# Altium project analogtestboard3.PRJPCB
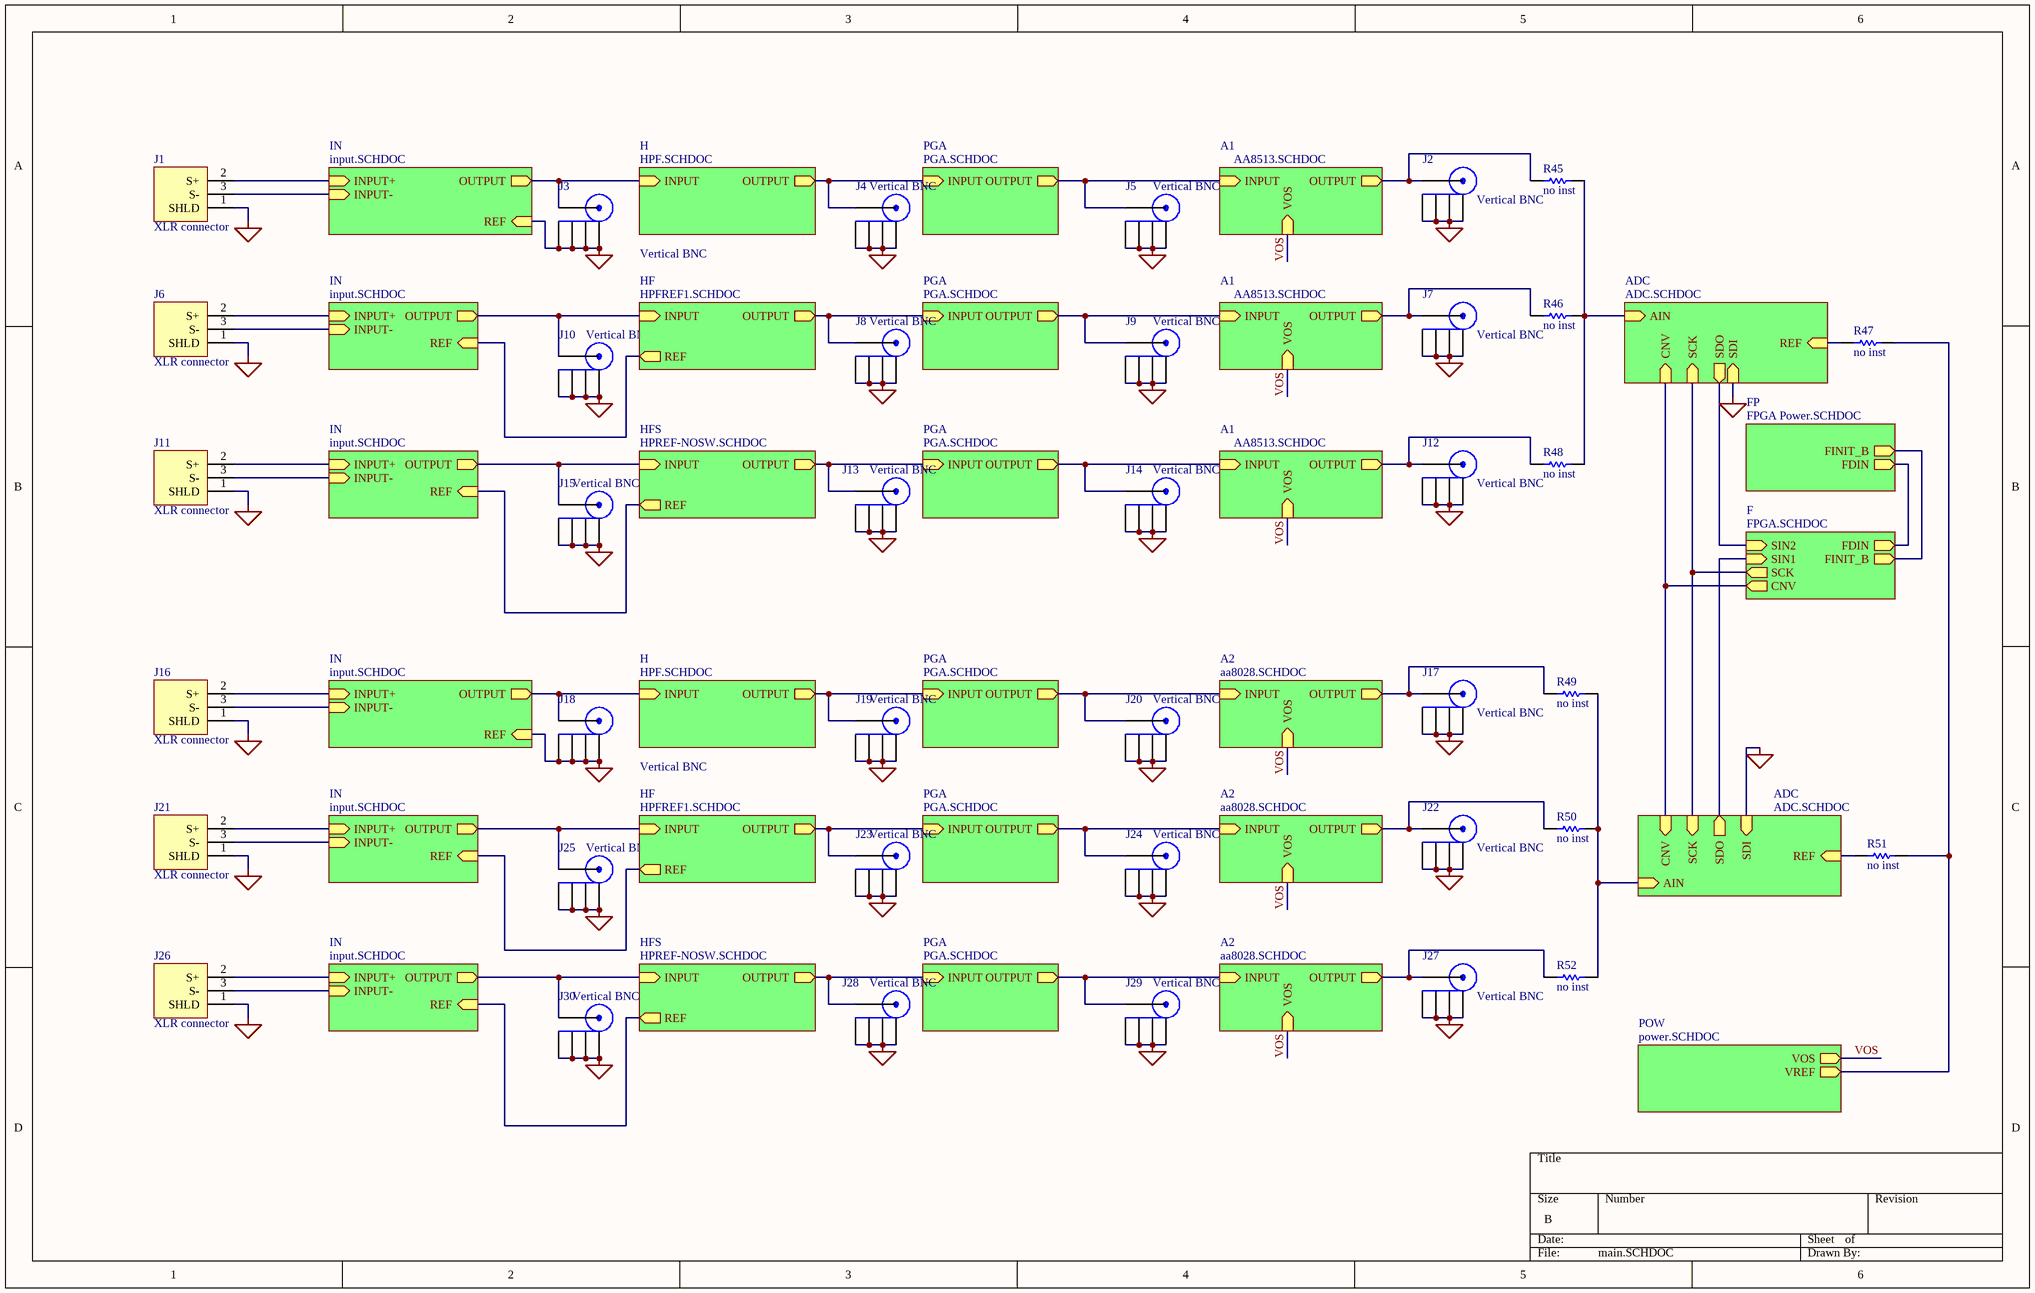
[diagram p0: main.SCHDOC]
12 sheets, 448 parts. Net scope: hierarchical (ports join the sheet entries above them; power ports are global).
Board file: analogtestboard3.PCBDOC
Sheets:
  main.SCHDOC
    IN = input.SCHDOC
    IN = input.SCHDOC
    A1 = AA8513.SCHDOC
    HF = HPFREF1.SCHDOC
    PGA = PGA.SCHDOC
    H = HPF.SCHDOC
    IN = input.SCHDOC
    PGA = PGA.SCHDOC
    PGA = PGA.SCHDOC
    A1 = AA8513.SCHDOC
    A1 = AA8513.SCHDOC
    HFS = HPREF-NOSW.SCHDOC
    IN = input.SCHDOC
    IN = input.SCHDOC
    HF = HPFREF1.SCHDOC
    PGA = PGA.SCHDOC
    H = HPF.SCHDOC
    IN = input.SCHDOC
    PGA = PGA.SCHDOC
    PGA = PGA.SCHDOC
    HFS = HPREF-NOSW.SCHDOC
    A2 = aa8028.SCHDOC
    A2 = aa8028.SCHDOC
    A2 = aa8028.SCHDOC
    ADC = ADC.SCHDOC
    ADC = ADC.SCHDOC
    F = FPGA.SCHDOC
    POW = power.SCHDOC
    FP = FPGA Power.SCHDOC

## Sheet main.SCHDOC
size B

### Parts
J1  XLR connector  [NC3FAH-0]
J2  Vertical BNC  [Vertical BNC 227699-1]
J3  Vertical BNC  [Vertical BNC 227699-1]
J4  Vertical BNC  [Vertical BNC 227699-1]
J5  Vertical BNC  [Vertical BNC 227699-1]
J6  XLR connector  [NC3FAH-0]
J7  Vertical BNC  [Vertical BNC 227699-1]
J8  Vertical BNC  [Vertical BNC 227699-1]
J9  Vertical BNC  [Vertical BNC 227699-1]
J10  Vertical BNC  [Vertical BNC 227699-1]
J11  XLR connector  [NC3FAH-0]
J12  Vertical BNC  [Vertical BNC 227699-1]
J13  Vertical BNC  [Vertical BNC 227699-1]
J14  Vertical BNC  [Vertical BNC 227699-1]
J15  Vertical BNC  [Vertical BNC 227699-1]
J16  XLR connector  [NC3FAH-0]
J17  Vertical BNC  [Vertical BNC 227699-1]
J18  Vertical BNC  [Vertical BNC 227699-1]
J19  Vertical BNC  [Vertical BNC 227699-1]
J20  Vertical BNC  [Vertical BNC 227699-1]
J21  XLR connector  [NC3FAH-0]
J22  Vertical BNC  [Vertical BNC 227699-1]
J23  Vertical BNC  [Vertical BNC 227699-1]
J24  Vertical BNC  [Vertical BNC 227699-1]
J25  Vertical BNC  [Vertical BNC 227699-1]
J26  XLR connector  [NC3FAH-0]
J27  Vertical BNC  [Vertical BNC 227699-1]
J28  Vertical BNC  [Vertical BNC 227699-1]
J29  Vertical BNC  [Vertical BNC 227699-1]
J30  Vertical BNC  [Vertical BNC 227699-1]
R45  no inst  [1206]
R46  no inst  [1206]
R47  no inst  [1206]
R48  no inst  [1206]
R49  no inst  [1206]
R50  no inst  [1206]
R51  no inst  [1206]
R52  no inst  [1206]

### Sub-sheets
A1 = AA8513.SCHDOC: OUTPUT (out), INPUT (in), VOS (in)
A1 = AA8513.SCHDOC: OUTPUT (out), INPUT (in), VOS (in)
A1 = AA8513.SCHDOC: OUTPUT (out), INPUT (in), VOS (in)
A2 = aa8028.SCHDOC: OUTPUT (out), INPUT (in), VOS (in)
A2 = aa8028.SCHDOC: OUTPUT (out), INPUT (in), VOS (in)
A2 = aa8028.SCHDOC: OUTPUT (out), INPUT (in), VOS (in)
ADC = ADC.SCHDOC: AIN (in), REF (in), SDI (in), SCK (in), SDO (out), CNV (in)
ADC = ADC.SCHDOC: AIN (in), REF (in), SDI (in), SCK (in), SDO (out), CNV (in)
F = FPGA.SCHDOC: FDIN (out), FINIT_B (out), SIN2 (in), SIN1 (in), SCK (out), CNV (out)
FP = FPGA Power.SCHDOC: FDIN (out), FINIT_B (out)
H = HPF.SCHDOC: INPUT (in), OUTPUT (out)
H = HPF.SCHDOC: INPUT (in), OUTPUT (out)
HF = HPFREF1.SCHDOC: INPUT (in), OUTPUT (out), REF (out)
HF = HPFREF1.SCHDOC: INPUT (in), OUTPUT (out), REF (out)
HFS = HPREF-NOSW.SCHDOC: INPUT (in), OUTPUT (out), REF (out)
HFS = HPREF-NOSW.SCHDOC: INPUT (in), OUTPUT (out), REF (out)
IN = input.SCHDOC: INPUT+ (in), INPUT- (in), OUTPUT (out), REF (in)
IN = input.SCHDOC: INPUT+ (in), INPUT- (in), OUTPUT (out), REF (in)
IN = input.SCHDOC: INPUT+ (in), INPUT- (in), OUTPUT (out), REF (in)
IN = input.SCHDOC: INPUT+ (in), INPUT- (in), OUTPUT (out), REF (in)
IN = input.SCHDOC: INPUT+ (in), INPUT- (in), OUTPUT (out), REF (in)
IN = input.SCHDOC: INPUT+ (in), INPUT- (in), OUTPUT (out), REF (in)
PGA = PGA.SCHDOC: OUTPUT (out), INPUT (in)
PGA = PGA.SCHDOC: OUTPUT (out), INPUT (in)
PGA = PGA.SCHDOC: OUTPUT (out), INPUT (in)
PGA = PGA.SCHDOC: OUTPUT (out), INPUT (in)
PGA = PGA.SCHDOC: OUTPUT (out), INPUT (in)
PGA = PGA.SCHDOC: OUTPUT (out), INPUT (in)
POW = power.SCHDOC: VOS (out), VREF (out)

### Nets
AGND: J1.1(SHLD) J2.2(SHLD) J2.3(SHLD) J2.4(SHLD) J2.5(SHLD) J3.2(SHLD) J3.3(SHLD) J3.4(SHLD) J3.5(SHLD) J4.2(SHLD) J4.3(SHLD) J4.4(SHLD) J4.5(SHLD) J5.2(SHLD) J5.3(SHLD) J5.4(SHLD) J5.5(SHLD) J6.1(SHLD) J7.2(SHLD) J7.3(SHLD) J7.4(SHLD) J7.5(SHLD) J8.2(SHLD) J8.3(SHLD) J8.4(SHLD) J8.5(SHLD) J9.2(SHLD) J9.3(SHLD) J9.4(SHLD) J9.5(SHLD) J10.2(SHLD) J10.3(SHLD) J10.4(SHLD) J10.5(SHLD) J11.1(SHLD) J12.2(SHLD) J12.3(SHLD) J12.4(SHLD) J12.5(SHLD) J13.2(SHLD) J13.3(SHLD) J13.4(SHLD) J13.5(SHLD) J14.2(SHLD) J14.3(SHLD) J14.4(SHLD) J14.5(SHLD) J15.2(SHLD) J15.3(SHLD) J15.4(SHLD) J15.5(SHLD) J16.1(SHLD) J17.2(SHLD) J17.3(SHLD) J17.4(SHLD) J17.5(SHLD) J18.2(SHLD) J18.3(SHLD) J18.4(SHLD) J18.5(SHLD) J19.2(SHLD) J19.3(SHLD) J19.4(SHLD) J19.5(SHLD) J20.2(SHLD) J20.3(SHLD) J20.4(SHLD) J20.5(SHLD) J21.1(SHLD) J22.2(SHLD) J22.3(SHLD) J22.4(SHLD) J22.5(SHLD) J23.2(SHLD) J23.3(SHLD) J23.4(SHLD) J23.5(SHLD) J24.2(SHLD) J24.3(SHLD) J24.4(SHLD) J24.5(SHLD) J25.2(SHLD) J25.3(SHLD) J25.4(SHLD) J25.5(SHLD) J26.1(SHLD) J27.2(SHLD) J27.3(SHLD) J27.4(SHLD) J27.5(SHLD) J28.2(SHLD) J28.3(SHLD) J28.4(SHLD) J28.5(SHLD) J29.2(SHLD) J29.3(SHLD) J29.4(SHLD) J29.5(SHLD) J30.2(SHLD) J30.3(SHLD) J30.4(SHLD) J30.5(SHLD) ; sheet IN/REF, sheet IN/REF, sheet ADC/SDI, sheet ADC/SDI
FDIN: sheet F/FDIN, sheet FP/FDIN
FINIT_B: sheet F/FINIT_B, sheet FP/FINIT_B
VOS: sheet A1/VOS, sheet A1/VOS, sheet A1/VOS, sheet A2/VOS, sheet A2/VOS, sheet A2/VOS, sheet POW/VOS
VREF: R47.2 R51.2 ; sheet POW/VREF
NetC4:A21_1: J17.1(PIN) R49.1 ; sheet A2/OUTPUT
NetC4:A22_1: J22.1(PIN) R50.1 ; sheet A2/OUTPUT
NetC4:A23_1: J27.1(PIN) R52.1 ; sheet A2/OUTPUT
NetC20:A11_1: J7.1(PIN) R46.1 ; sheet A1/OUTPUT
NetC20:A12_1: J12.1(PIN) R48.1 ; sheet A1/OUTPUT
NetC20:A13_1: J2.1(PIN) R45.1 ; sheet A1/OUTPUT
NetC33:ADC1_2: R47.1 ; sheet ADC/REF
NetC33:ADC2_2: R51.1 ; sheet ADC/REF
NetC57:H1_2: J3.1(PIN) ; sheet IN/OUTPUT, sheet H/INPUT
NetC57:H2_2: J18.1(PIN) ; sheet IN/OUTPUT, sheet H/INPUT
NetC63:HFS1_2: sheet IN/REF, sheet HFS/REF
NetC63:HFS2_2: sheet IN/REF, sheet HFS/REF
NetJ1_2: J1.2(S+) ; sheet IN/INPUT+
NetJ1_3: J1.3(S-) ; sheet IN/INPUT-
NetJ4_1: J4.1(PIN) ; sheet H/OUTPUT, sheet PGA/INPUT
NetJ5_1: J5.1(PIN) ; sheet PGA/OUTPUT, sheet A1/INPUT
NetJ6_2: J6.2(S+) ; sheet IN/INPUT+
NetJ6_3: J6.3(S-) ; sheet IN/INPUT-
NetJ8_1: J8.1(PIN) J10.1(PIN) ; sheet IN/OUTPUT, sheet HF/INPUT, sheet HF/OUTPUT, sheet PGA/INPUT
NetJ9_1: J9.1(PIN) ; sheet A1/INPUT, sheet PGA/OUTPUT
NetJ11_2: J11.2(S+) ; sheet IN/INPUT+
NetJ11_3: J11.3(S-) ; sheet IN/INPUT-
NetJ13_1: J13.1(PIN) J15.1(PIN) ; sheet IN/OUTPUT, sheet PGA/INPUT, sheet HFS/INPUT, sheet HFS/OUTPUT
NetJ14_1: J14.1(PIN) ; sheet PGA/OUTPUT, sheet A1/INPUT
NetJ16_2: J16.2(S+) ; sheet IN/INPUT+
NetJ16_3: J16.3(S-) ; sheet IN/INPUT-
NetJ19_1: J19.1(PIN) ; sheet H/OUTPUT, sheet PGA/INPUT
NetJ20_1: J20.1(PIN) ; sheet PGA/OUTPUT, sheet A2/INPUT
NetJ21_2: J21.2(S+) ; sheet IN/INPUT+
NetJ21_3: J21.3(S-) ; sheet IN/INPUT-
NetJ23_1: J23.1(PIN) J25.1(PIN) ; sheet IN/OUTPUT, sheet HF/INPUT, sheet HF/OUTPUT, sheet PGA/INPUT
NetJ24_1: J24.1(PIN) ; sheet PGA/OUTPUT, sheet A2/INPUT
NetJ26_2: J26.2(S+) ; sheet IN/INPUT+
NetJ26_3: J26.3(S-) ; sheet IN/INPUT-
NetJ28_1: J28.1(PIN) J30.1(PIN) ; sheet IN/OUTPUT, sheet PGA/INPUT, sheet HFS/INPUT, sheet HFS/OUTPUT
NetJ29_1: J29.1(PIN) ; sheet PGA/OUTPUT, sheet A2/INPUT
NetR25:ADC1_1: R45.2 R46.2 R48.2 ; sheet ADC/AIN
NetR25:ADC2_1: R49.2 R50.2 R52.2 ; sheet ADC/AIN
NetR27_2: sheet ADC/SDO, sheet F/SIN2
NetR28_1: sheet ADC/SCK, sheet ADC/SCK, sheet F/SCK
NetR29_1: sheet ADC/CNV, sheet ADC/CNV, sheet F/CNV
NetU5:ADC2_7: sheet ADC/SDO, sheet F/SIN1
NetU11:HF1_1: sheet IN/REF, sheet HF/REF
NetU11:HF2_1: sheet IN/REF, sheet HF/REF

### Library data of the parts
J1 J6 J11 J16 J21 J26 = XLR: XLR balanced connector, standard
J2-J5 J7-J10 J12-J15 J17-J20 J22-J25 J27-J30 = VERTBNC: Vertical BNC with correct grounding pin behavior
R45-R52 = Res1: Resistor; Value: 0; Published: 8-Jun-2000; LatestRevisionDate: 17-Jul-2002; LatestRevisionNote: Re-released for DXP Platform.; Publisher: Altium Limited

## Sheet input.SCHDOC
size B
Used 6 times, as channels IN, IN, IN, IN, IN, IN. Parts and nets are listed once, with the designators drawn on the sheet.
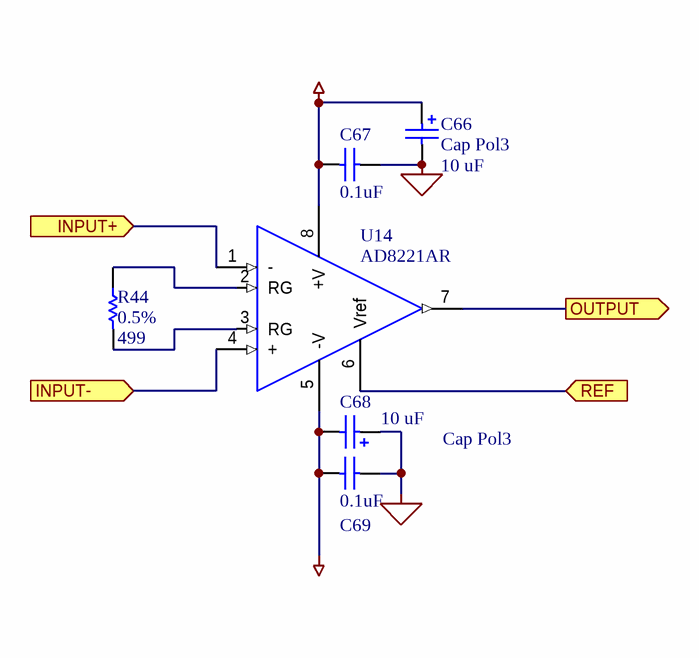
[diagram p1: input.SCHDOC]

### Parts
C66  Cap Pol3  value 10 uF  [TC3216-1206]
C67  value 0.1uF  [CC1608-0603]  (hidden comment: Cap)
C68  Cap Pol3  value 10 uF  [TC3216-1206]
C69  value 0.1uF  [CC1608-0603]  (hidden comment: Cap)
R44  0.5%  value 499  [R2012-0805]
U14  AD8221AR  [SO-G8]

### Ports
INPUT+ (in), INPUT- (in), OUTPUT (out), REF (in)

### Nets
AGND: C66.2 C67.2 C68.1 C69.2
AVDD: C66.1 C67.1 U14.8(+V)
AVSS: C68.2 C69.1 U14.5(-V)
INPUT+: U14.1(-) ; port INPUT+
INPUT-: U14.4(+) ; port INPUT-
OUTPUT: U14.7(Vout) ; port OUTPUT
REF: U14.6(Vref) ; port REF
NetR44_1: R44.1 U14.2(RG)
NetR44_2: R44.2 U14.3(RG)

### Channels
IN: designators end in :IN1; ports INPUT+=NetJ6_2 INPUT-=NetJ6_3 OUTPUT=NetJ8_1 REF=NetU11:HF1_1
IN: designators end in :IN2; ports INPUT+=NetJ1_2 INPUT-=NetJ1_3 OUTPUT=NetC57:H1_2 REF=AGND
IN: designators end in :IN3; ports INPUT+=NetJ11_2 INPUT-=NetJ11_3 OUTPUT=NetJ13_1 REF=NetC63:HFS1_2
IN: designators end in :IN4; ports INPUT+=NetJ21_2 INPUT-=NetJ21_3 OUTPUT=NetJ23_1 REF=NetU11:HF2_1
IN: designators end in :IN5; ports INPUT+=NetJ16_2 INPUT-=NetJ16_3 OUTPUT=NetC57:H2_2 REF=AGND
IN: designators end in :IN6; ports INPUT+=NetJ26_2 INPUT-=NetJ26_3 OUTPUT=NetJ28_1 REF=NetC63:HFS2_2

### Library data of the parts
C66 C68 = Cap Pol3: Polarized Capacitor (Surface Mount); Manufacturer: Generic Components; Class I: Passive; Published: 8-Jun-2000; Revision: July-2002: Re-released for DXP Platform.; Publisher: Altium Limited; Class II: Capacitor
C67 C69 = Cap: Capacitor; Manufacturer: Generic Components; Class I: Passive; Published: 8-Jun-2000; Revision: July-2002: Re-released for DXP Platform.; Publisher: Altium Limited; Class II: Capacitor
R44 = Res1: RR1220P-4990-D-M; Manufacturer: Generic Components; Class I: Passive; Class II: Resistor; Published: 8-Jun-2000; Revision: July-2002: Re-released for DXP Platform.; Publisher: Altium Limited
U14 = AD8221: AD8221 Precision Instrumentation Amplifier

## Sheet AA8513.SCHDOC
size B
Used 3 times, as channels A1, A1, A1. Parts and nets are listed once, with the designators drawn on the sheet.
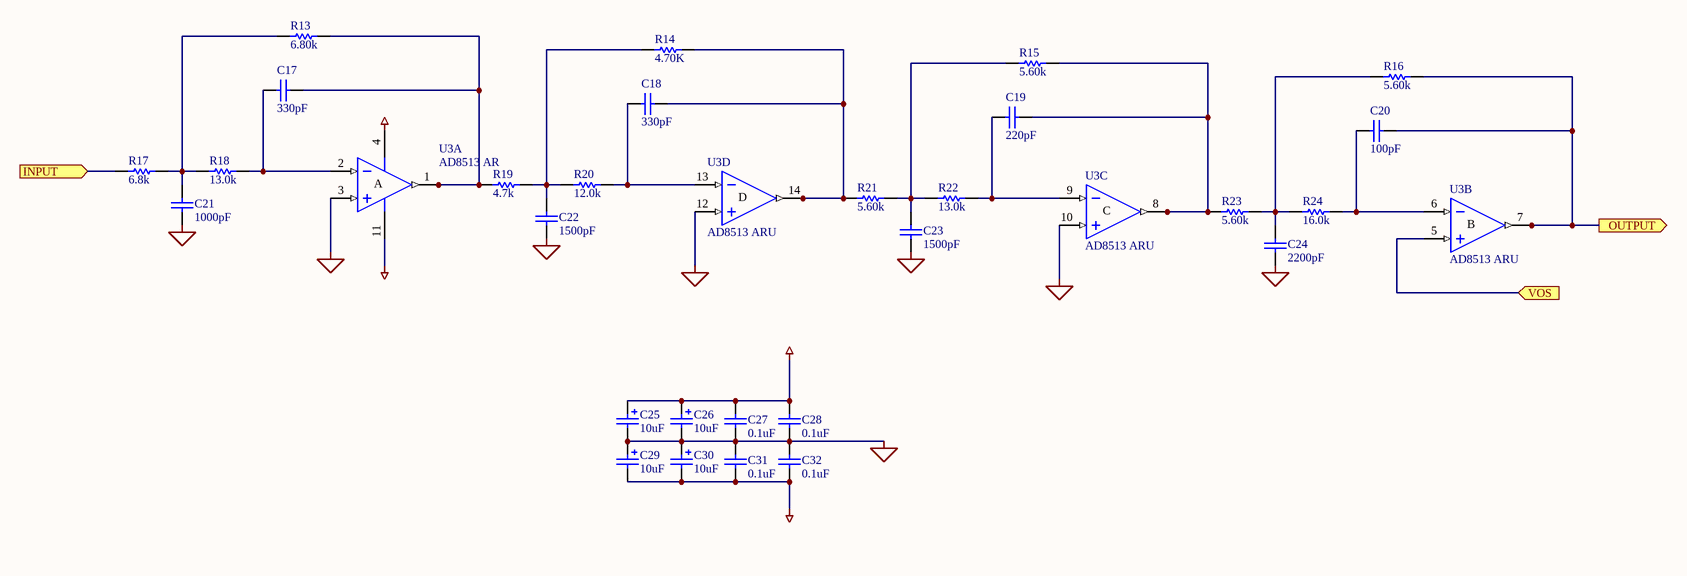
[diagram p2: AA8513.SCHDOC]

### Parts
C17  value 330pF  [CC1608-0603]  (hidden comment: Cap)
C18  value 330pF  [CC1608-0603]  (hidden comment: Cap)
C19  value 220pF  [CC1608-0603]  (hidden comment: Cap)
C20  value 100pF  [CC1608-0603]  (hidden comment: Cap)
C21  value 1000pF  [CC1608-0603]  (hidden comment: Cap)
C22  value 1500pF  [CC1608-0603]  (hidden comment: Cap)
C23  value 1500pF  [CC1608-0603]  (hidden comment: Cap)
C24  value 2200pF  [CC1608-0603]  (hidden comment: Cap)
C25  value 10uF  [TC3528-1411]  (hidden comment: Cap Pol1)
C26  value 10uF  [TC3528-1411]  (hidden comment: Cap Pol1)
C27  value 0.1uF  [CC1608-0603]  (hidden comment: Cap)
C28  value 0.1uF  [CC1608-0603]  (hidden comment: Cap)
C29  value 10uF  [TC3528-1411]  (hidden comment: Cap Pol1)
C30  value 10uF  [TC3528-1411]  (hidden comment: Cap Pol1)
C31  value 0.1uF  [CC1608-0603]  (hidden comment: Cap)
C32  value 0.1uF  [CC1608-0603]  (hidden comment: Cap)
R13  value 6.80k  [CC1608-0603]  (hidden comment: Res1)
R14  value 4.70K  [CC1608-0603]  (hidden comment: Res1)
R15  value 5.60k  [CC1608-0603]  (hidden comment: Res1)
R16  value 5.60k  [CC1608-0603]  (hidden comment: Res1)
R17  value 6.8k  [CC1608-0603]  (hidden comment: Res1)
R18  value 13.0k  [CC1608-0603]  (hidden comment: Res1)
R19  value 4.7k  [CC1608-0603]  (hidden comment: Res1)
R20  value 12.0k  [CC1608-0603]  (hidden comment: Res1)
R21  value 5.60k  [CC1608-0603]  (hidden comment: Res1)
R22  value 13.0k  [CC1608-0603]  (hidden comment: Res1)
R23  value 5.60k  [CC1608-0603]  (hidden comment: Res1)
R24  value 16.0k  [CC1608-0603]  (hidden comment: Res1)
U3  AD8513 AR  [SO-G14]  (parts A,B,C,D of 4)

### Ports
INPUT (in), OUTPUT (out), VOS (in)

### Nets
AGND: C21.1 C22.1 C23.1 C24.1 C25.2 C26.2 C27.1 C28.1 C29.1 C30.1 C31.2 C32.2 U3.3(IN+A) U3.10(IN+C) U3.12(IN+D)
AVDD: C25.1 C26.1 C27.2 C28.2 U3.4(V+)
AVSS: C29.2 C30.2 C31.1 C32.1 U3.11(V-)
INPUT: R17.1 ; port INPUT
OUTPUT: C20.1 R16.1 U3.7(OUTB) ; port OUTPUT
VOS: U3.5(IN+B) ; port VOS
NetC17_1: C17.1 R13.1 R19.1 U3.1(OUTA)
NetC17_2: C17.2 R18.2 U3.2(IN-A)
NetC18_1: C18.1 R14.1 R21.1 U3.14(OUTD)
NetC18_2: C18.2 R20.2 U3.13(IN-D)
NetC19_1: C19.1 R15.1 R23.1 U3.8(OUTC)
NetC19_2: C19.2 R22.2 U3.9(IN-C)
NetC20_2: C20.2 R24.2 U3.6(IN-B)
NetC21_2: C21.2 R13.2 R17.2 R18.1
NetC22_2: C22.2 R14.2 R19.2 R20.1
NetC23_2: C23.2 R15.2 R21.2 R22.1
NetC24_2: C24.2 R16.2 R23.2 R24.1

### Channels
A1: designators end in :A11; ports INPUT=NetJ9_1 OUTPUT=NetC20:A11_1 VOS=VOS
A1: designators end in :A12; ports INPUT=NetJ14_1 OUTPUT=NetC20:A12_1 VOS=VOS
A1: designators end in :A13; ports INPUT=NetJ5_1 OUTPUT=NetC20:A13_1 VOS=VOS

### Notes on the sheet
- (in symbol AD8513ARU, part A) A
- (in symbol AD8513ARU, part B) B
- (in symbol AD8513ARU, part C) C
- (in symbol AD8513ARU, part D) D

### Library data of the parts
C17-C24 C27 C28 C31 C32 = Cap: as C67 on sheet input; Published: 8-Jun-2000; Revision: July-2002: Re-released for DXP Platform.; Publisher: Altium Limited; Class II: Capacitor
C25 C26 C29 C30 = Cap Pol1: Polarized Capacitor (Radial); Manufacturer: Generic Components; Class I: Passive; Published: 8-Jun-2000; Revision: July-2002: Re-released for DXP Platform.; Publisher: Altium Limited; Class II: Capacitor
R13-R24 = Res1: Resistor; Manufacturer: Generic Components; Class I: Passive; Published: 8-Jun-2000; Revision: July-2002: Re-released for DXP Platform.; Publisher: Altium Limited; Class II: Resistor
U3 = AD8513ARU: low-noise JFET quad OA

## Sheet HPFREF1.SCHDOC
size B
Used 2 times, as channels HF, HF. Parts and nets are listed once, with the designators drawn on the sheet.
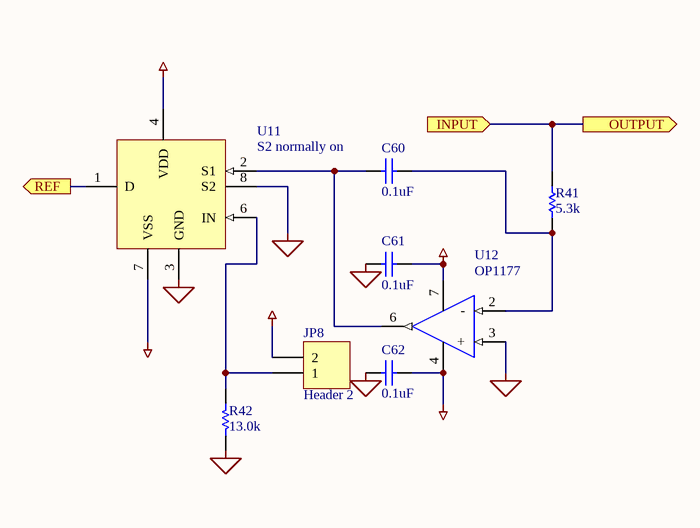
[diagram p3: HPFREF1.SCHDOC]

### Parts
C60  value 0.1uF  [CC3216-1206]  (hidden comment: Cap)
C61  value 0.1uF  [CC1608-0603]  (hidden comment: Cap)
C62  value 0.1uF  [CC1608-0603]  (hidden comment: Cap)
JP8  Header 2  [HDR1X2]
R41  value 5.3k  [CC2012-0805]  (hidden comment: Res1)
R42  value 13.0k  [CC2012-0805]  (hidden comment: Res1)
U11  S2 normally on  [MSOP8]
U12  OP1177  [SO-G8/X.6]

### Ports
INPUT (in), OUTPUT (out), REF (out)

### Nets
AGND: C61.1 C62.1 R42.1 U11.3(GND) U11.8(S2) U12.3(+)
AVDD: C61.2 JP8.2 U11.4(VDD) U12.7(+Vs)
AVSS: C62.2 U11.7(VSS) U12.4(-Vs)
INPUT: R41.1 ; port INPUT, port OUTPUT
REF: U11.1(D) ; port REF
NetC60_1: C60.1 R41.2 U12.2(-)
NetC60_2: C60.2 U11.2(S1) U12.6(Out)
NetJP8_1: JP8.1 R42.2 U11.6(IN)

### Channels
HF: designators end in :HF1; ports INPUT=NetJ8_1 OUTPUT=NetJ8_1 REF=NetU11:HF1_1
HF: designators end in :HF2; ports INPUT=NetJ23_1 OUTPUT=NetJ23_1 REF=NetU11:HF2_1

### Library data of the parts
C60-C62 = Cap: as C67 on sheet input; Published: 8-Jun-2000; Revision: July-2002: Re-released for DXP Platform.; Publisher: Altium Limited; Class II: Capacitor
JP8 = Header 2: Header, 2-Pin; Manufacturer: Generic Components; Class I: Connector; Revision: July-2002: Re-released for DXP Platform.; Publisher: Altium Limited
R41 R42 = Res1: as R13 on sheet AA8513; Published: 8-Jun-2000; Revision: July-2002: Re-released for DXP Platform.; Publisher: Altium Limited; Class II: Resistor
U11 = ADG619: Low RON SPDT Switch
U12 = OP1177: AD Precision Low Noise, Low Input Bias Current Operational Amplifier

## Sheet PGA.SCHDOC
size B
Used 6 times, as channels PGA, PGA, PGA, PGA, PGA, PGA. Parts and nets are listed once, with the designators drawn on the sheet.
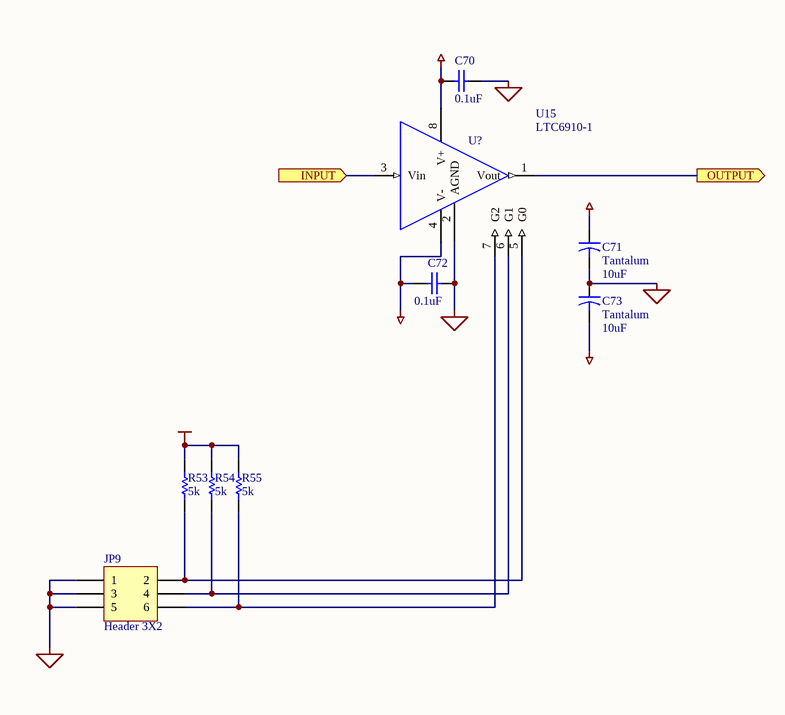
[diagram p4: PGA.SCHDOC]

### Parts
C70  value 0.1uF  [CC1608-0603]  (hidden comment: Cap)
C71  Tantalum  value 10uF  [TC3216-1206]
C72  value 0.1uF  [CC1608-0603]  (hidden comment: Cap)
C73  Tantalum  value 10uF  [TC3216-1206]
JP9  Header 3X2  [HDR2X3]
R53  value 5k  [CC2012-0805]  (hidden comment: Res1)
R54  value 5k  [CC2012-0805]  (hidden comment: Res1)
R55  value 5k  [CC2012-0805]  (hidden comment: Res1)
U15  LTC6910-1  [TSOT-23-8]

### Ports
INPUT (in), OUTPUT (out)

### Nets
AGND: C70.2 C71.2 C72.1 C73.1 JP9.1 JP9.3 JP9.5 U15.2(AGND)
AVDD: C70.1 C71.1 R53.2 R54.2 R55.2 U15.8(V+)
AVSS: C72.2 C73.2 U15.4(V-)
INPUT: U15.3(Vin) ; port INPUT
OUTPUT: U15.1(Vout) ; port OUTPUT
NetJP9_2: JP9.2 R53.1 U15.5(G0)
NetJP9_4: JP9.4 R54.1 U15.6(G1)
NetJP9_6: JP9.6 R55.1 U15.7(G2)

### Channels
PGA: designators end in :PGA1; ports INPUT=NetJ8_1 OUTPUT=NetJ9_1
PGA: designators end in :PGA2; ports INPUT=NetJ13_1 OUTPUT=NetJ14_1
PGA: designators end in :PGA3; ports INPUT=NetJ4_1 OUTPUT=NetJ5_1
PGA: designators end in :PGA4; ports INPUT=NetJ23_1 OUTPUT=NetJ24_1
PGA: designators end in :PGA5; ports INPUT=NetJ28_1 OUTPUT=NetJ29_1
PGA: designators end in :PGA6; ports INPUT=NetJ19_1 OUTPUT=NetJ20_1

### Notes on the sheet
- (in symbol LTC6910-2) U?

### Library data of the parts
C70 C72 = Cap: as C67 on sheet input; Published: 8-Jun-2000; Revision: July-2002: Re-released for DXP Platform.; Publisher: Altium Limited; Class II: Capacitor
C71 C73 = Cap2: Capacitor; Manufacturer: Generic Components; Class I: Passive; Published: 23-Sep-2002; Publisher: Altium Limited; Class II: Capacitor
JP9 = Header 3X2: Header, 3-Pin, Dual row; Manufacturer: Generic Components; Class I: Connector; Revision: July-2002: Re-released for DXP Platform.; Publisher: Altium Limited
R53-R55 = Res1: as R13 on sheet AA8513; Published: 8-Jun-2000; Revision: July-2002: Re-released for DXP Platform.; Publisher: Altium Limited; Class II: Resistor
U15 = LTC6910-2: LTI Digitally Controlled Programmabe Gain Amp

## Sheet HPF.SCHDOC
size B
Used 2 times, as channels H, H. Parts and nets are listed once, with the designators drawn on the sheet.
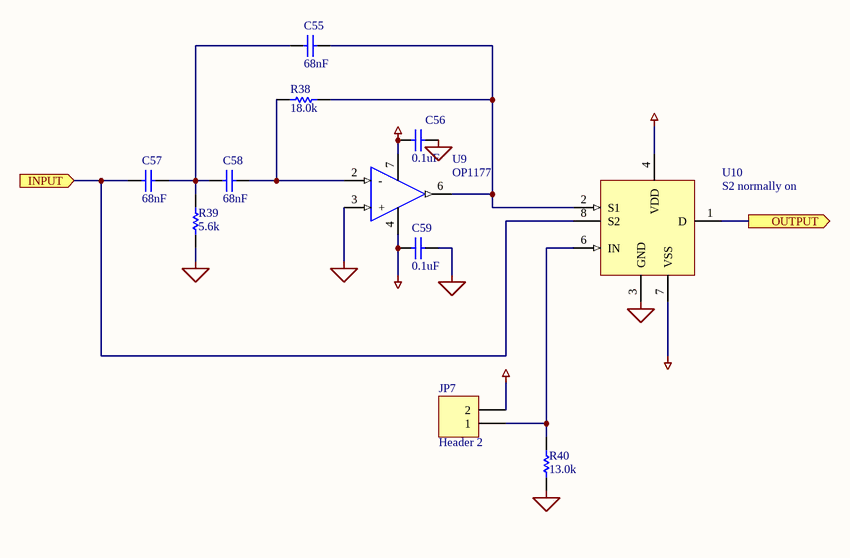
[diagram p5: HPF.SCHDOC]

### Parts
C55  value 68nF  [CC3216-1206]  (hidden comment: Cap)
C56  value 0.1uF  [CC1608-0603]  (hidden comment: Cap)
C57  value 68nF  [CC3216-1206]  (hidden comment: Cap)
C58  value 68nF  [CC3216-1206]  (hidden comment: Cap)
C59  value 0.1uF  [CC1608-0603]  (hidden comment: Cap)
JP7  Header 2  [HDR1X2]
R38  value 18.0k  [CC2012-0805]  (hidden comment: Res1)
R39  value 5.6k  [CC2012-0805]  (hidden comment: Res1)
R40  value 13.0k  [CC2012-0805]  (hidden comment: Res1)
U9  OP1177  [SO-G8/X.6]
U10  S2 normally on  [MSOP8]

### Ports
INPUT (in), OUTPUT (out)

### Nets
AGND: C56.2 C59.2 R39.1 R40.1 U9.3(+) U10.3(GND)
AVDD: C56.1 JP7.2 U9.7(+Vs) U10.4(VDD)
AVSS: C59.1 U9.4(-Vs) U10.7(VSS)
INPUT: C57.2 U10.8(S2) ; port INPUT
OUTPUT: U10.1(D) ; port OUTPUT
NetC55_1: C55.1 R38.1 U9.6(Out) U10.2(S1)
NetC55_2: C55.2 C57.1 C58.2 R39.2
NetC58_1: C58.1 R38.2 U9.2(-)
NetJP7_1: JP7.1 R40.2 U10.6(IN)

### Channels
H: designators end in :H1; ports INPUT=NetC57:H1_2 OUTPUT=NetJ4_1
H: designators end in :H2; ports INPUT=NetC57:H2_2 OUTPUT=NetJ19_1

### Library data of the parts
C55-C59 = Cap: as C67 on sheet input; Published: 8-Jun-2000; Revision: July-2002: Re-released for DXP Platform.; Publisher: Altium Limited; Class II: Capacitor
JP7 = Header 2: as JP8 on sheet HPFREF1; Revision: July-2002: Re-released for DXP Platform.; Publisher: Altium Limited
R38-R40 = Res1: as R13 on sheet AA8513; Published: 8-Jun-2000; Revision: July-2002: Re-released for DXP Platform.; Publisher: Altium Limited; Class II: Resistor
U9 = OP1177: as U12 on sheet HPFREF1
U10 = ADG619: Low RON SPDT Switch

## Sheet HPREF-NOSW.SCHDOC
size B
Used 2 times, as channels HFS, HFS. Parts and nets are listed once, with the designators drawn on the sheet.
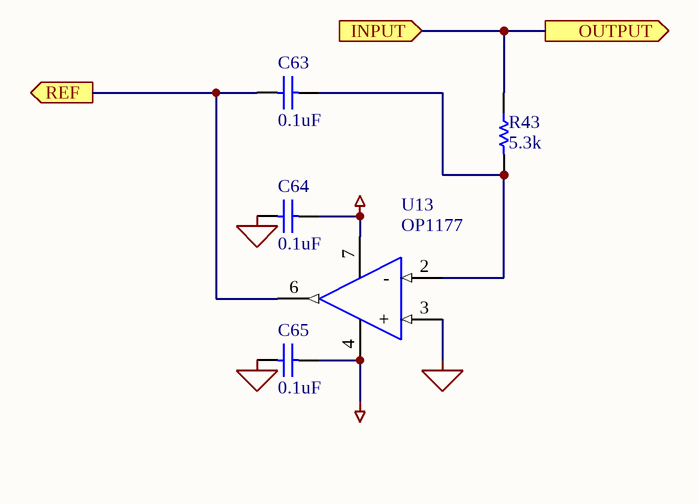
[diagram p6: HPREF-NOSW.SCHDOC]

### Parts
C63  value 0.1uF  [CC3216-1206]  (hidden comment: Cap)
C64  value 0.1uF  [CC1608-0603]  (hidden comment: Cap)
C65  value 0.1uF  [CC1608-0603]  (hidden comment: Cap)
R43  value 5.3k  [CC2012-0805]  (hidden comment: Res1)
U13  OP1177  [SO-G8/X.6]

### Ports
INPUT (in), OUTPUT (out), REF (out)

### Nets
AGND: C64.1 C65.1 U13.3(+)
AVDD: C64.2 U13.7(+Vs)
AVSS: C65.2 U13.4(-Vs)
INPUT: R43.1 ; port INPUT, port OUTPUT
REF: C63.2 U13.6(Out) ; port REF
NetC63_1: C63.1 R43.2 U13.2(-)

### Channels
HFS: designators end in :HFS1; ports INPUT=NetJ13_1 OUTPUT=NetJ13_1 REF=NetC63:HFS1_2
HFS: designators end in :HFS2; ports INPUT=NetJ28_1 OUTPUT=NetJ28_1 REF=NetC63:HFS2_2

### Library data of the parts
C63-C65 = Cap: as C67 on sheet input; Published: 8-Jun-2000; Revision: July-2002: Re-released for DXP Platform.; Publisher: Altium Limited; Class II: Capacitor
R43 = Res1: as R13 on sheet AA8513; Published: 8-Jun-2000; Revision: July-2002: Re-released for DXP Platform.; Publisher: Altium Limited; Class II: Resistor
U13 = OP1177: as U12 on sheet HPFREF1

## Sheet aa8028.SCHDOC
size B
Used 3 times, as channels A2, A2, A2. Parts and nets are listed once, with the designators drawn on the sheet.
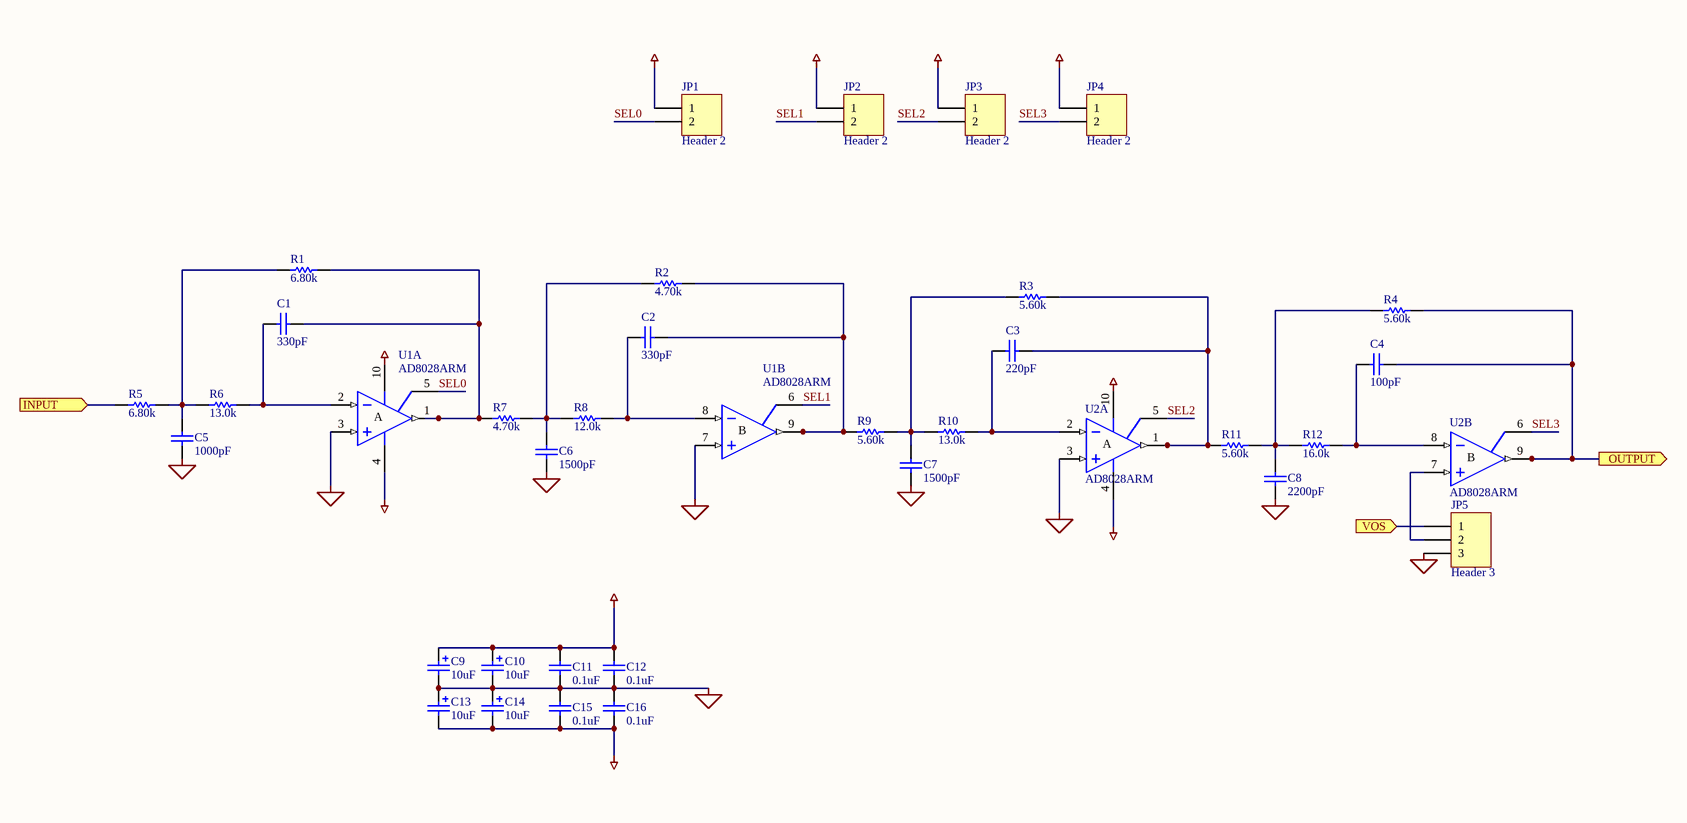
[diagram p7: aa8028.SCHDOC]

### Parts
C1  value 330pF  [0603]  (hidden comment: Cap)
C2  value 330pF  [0603]  (hidden comment: Cap)
C3  value 220pF  [0603]  (hidden comment: Cap)
C4  value 100pF  [0603]  (hidden comment: Cap)
C5  value 1000pF  [0603]  (hidden comment: Cap)
C6  value 1500pF  [0603]  (hidden comment: Cap)
C7  value 1500pF  [0603]  (hidden comment: Cap)
C8  value 2200pF  [0603]  (hidden comment: Cap)
C9  value 10uF  [TC3528-1411]  (hidden comment: Cap Pol1)
C10  value 10uF  [TC3528-1411]  (hidden comment: Cap Pol1)
C11  value 0.1uF  [CC1608-0603]  (hidden comment: Cap)
C12  value 0.1uF  [CC1608-0603]  (hidden comment: Cap)
C13  value 10uF  [TC3528-1411]  (hidden comment: Cap Pol1)
C14  value 10uF  [TC3528-1411]  (hidden comment: Cap Pol1)
C15  value 0.1uF  [CC1608-0603]  (hidden comment: Cap)
C16  value 0.1uF  [CC1608-0603]  (hidden comment: Cap)
JP1  Header 2  [HDR1X2]
JP2  Header 2  [HDR1X2]
JP3  Header 2  [HDR1X2]
JP4  Header 2  [HDR1X2]
JP5  Header 3  [HDR1X3]
R1  value 6.80k  [0603]  (hidden comment: Res1)
R2  value 4.70k  [0603]  (hidden comment: Res1)
R3  value 5.60k  [0603]  (hidden comment: Res1)
R4  value 5.60k  [0603]  (hidden comment: Res1)
R5  value 6.80k  [0603]  (hidden comment: Res1)
R6  value 13.0k  [0603]  (hidden comment: Res1)
R7  value 4.70k  [0603]  (hidden comment: Res1)
R8  value 12.0k  [0603]  (hidden comment: Res1)
R9  value 5.60k  [0603]  (hidden comment: Res1)
R10  value 13.0k  [0603]  (hidden comment: Res1)
R11  value 5.60k  [0603]  (hidden comment: Res1)
R12  value 16.0k  [0603]  (hidden comment: Res1)
U1  AD8028ARM  [TSSO3x5-G10]  (parts A,B of 2)
U2  AD8028ARM  [TSSO3x5-G10]  (parts A,B of 2)

### Ports
INPUT (in), OUTPUT (out), VOS (in)

### Nets
AGND: C5.1 C6.1 C7.1 C8.1 C9.2 C10.2 C11.1 C12.1 C13.1 C14.1 C15.2 C16.2 JP5.3 U1.3(IN+A) U1.7(IN+B) U2.3(IN+A)
AVDD: C9.1 C10.1 C11.2 C12.2 JP1.1 JP2.1 JP3.1 JP4.1 U1.10(V+) U2.10(V+)
AVSS: C13.2 C14.2 C15.1 C16.1 U1.4(V-) U2.4(V-)
INPUT: R5.1 ; port INPUT
OUTPUT: C4.1 R4.1 U2.9(VOUTB) ; port OUTPUT
SEL0: JP1.2 U1.5(SELA)
SEL1: JP2.2 U1.6(SELB)
SEL2: JP3.2 U2.5(SELA)
SEL3: JP4.2 U2.6(SELB)
VOS: JP5.1 ; port VOS
NetC1_1: C1.1 R1.1 R7.1 U1.1(VOUTA)
NetC1_2: C1.2 R6.2 U1.2(IN-A)
NetC2_1: C2.1 R2.1 R9.1 U1.9(VOUTB)
NetC2_2: C2.2 R8.2 U1.8(IN-B)
NetC3_1: C3.1 R3.1 R11.1 U2.1(VOUTA)
NetC3_2: C3.2 R10.2 U2.2(IN-A)
NetC4_2: C4.2 R12.2 U2.8(IN-B)
NetC5_2: C5.2 R1.2 R5.2 R6.1
NetC6_2: C6.2 R2.2 R7.2 R8.1
NetC7_2: C7.2 R3.2 R9.2 R10.1
NetC8_2: C8.2 R4.2 R11.2 R12.1
NetJP5_2: JP5.2 U2.7(IN+B)

### Channels
A2: designators end in :A21; ports INPUT=NetJ20_1 OUTPUT=NetC4:A21_1 VOS=VOS
A2: designators end in :A22; ports INPUT=NetJ24_1 OUTPUT=NetC4:A22_1 VOS=VOS
A2: designators end in :A23; ports INPUT=NetJ29_1 OUTPUT=NetC4:A23_1 VOS=VOS

### Notes on the sheet
- (in symbol AD8028ARM, part A) A
- (in symbol AD8028ARM, part B) B

### Library data of the parts
C1-C8 C11 C12 C15 C16 = Cap: as C67 on sheet input; Published: 8-Jun-2000; Revision: July-2002: Re-released for DXP Platform.; Publisher: Altium Limited; Class II: Capacitor
C9 C10 C13 C14 = Cap Pol1: as C25 on sheet AA8513; Published: 8-Jun-2000; Revision: July-2002: Re-released for DXP Platform.; Publisher: Altium Limited; Class II: Capacitor
JP1-JP4 = Header 2: as JP8 on sheet HPFREF1; Revision: July-2002: Re-released for DXP Platform.; Publisher: Altium Limited
JP5 = Header 3: Header, 3-Pin; Manufacturer: Generic Components; Class I: Connector; Revision: July-2002: Re-released for DXP Platform.; Publisher: Altium Limited
R1-R12 = Res1: as R13 on sheet AA8513; Published: 8-Jun-2000; Revision: July-2002: Re-released for DXP Platform.; Publisher: Altium Limited; Class II: Resistor
U1 U2 = AD8028ARM: Analog Devices Low Distortion, High Speed RRIO OA

## Sheet ADC.SCHDOC
size A
Used 2 times, as channels ADC, ADC. Parts and nets are listed once, with the designators drawn on the sheet.
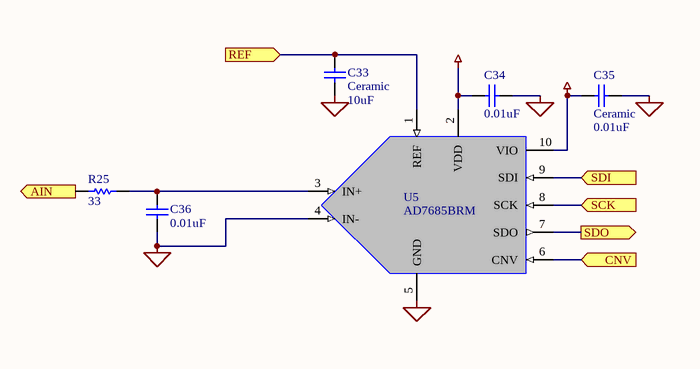
[diagram p8: ADC.SCHDOC]

### Parts
C33  Ceramic  value 10uF  [0805]
C34  value 0.01uF  [0603]  (hidden comment: Cap)
C35  Ceramic  value 0.01uF  [0603]
C36  value 0.01uF  [0603]  (hidden comment: Cap)
R25  value 33  [0603]  (hidden comment: Res1)
U5  AD7685BRM  [AD RM-10]

### Ports
AIN (in), CNV (in), REF (in), SCK (in), SDI (in), SDO (out)

### Nets
AGND: C33.1 C34.2 C35.1 C36.1 U5.4(IN-) U5.5(GND)
AVDD: C34.1 C35.2 U5.2(VDD) U5.10(VIO)
AIN: R25.1 ; port AIN
CNV: U5.6(CNV) ; port CNV
REF: C33.2 U5.1(REF) ; port REF
SCK: U5.8(SCK) ; port SCK
SDI: U5.9(SDI) ; port SDI
SDO: U5.7(SDO) ; port SDO
NetC36_2: C36.2 R25.2 U5.3(IN+)

### Channels
ADC: designators end in :ADC1; ports AIN=NetR25:ADC1_1 CNV=NetR29_1 REF=NetC33:ADC1_2 SCK=NetR28_1 SDI=AGND SDO=NetR27_2
ADC: designators end in :ADC2; ports AIN=NetR25:ADC2_1 CNV=NetR29_1 REF=NetC33:ADC2_2 SCK=NetR28_1 SDI=AGND SDO=NetU5:ADC2_7

### Library data of the parts
C33-C36 = Cap: Capacitor; Published: 8-Jun-2000; LatestRevisionDate: 17-Jul-2002; LatestRevisionNote: Re-released for DXP Platform.; Publisher: Altium Limited
R25 = Res1: Resistor; Published: 8-Jun-2000; LatestRevisionDate: 17-Jul-2002; LatestRevisionNote: Re-released for DXP Platform.; Publisher: Altium Limited
U5 = AD7685: AD 16-bit 250 kSPS ADC; Vendor: Analog Devices

## Sheet FPGA.SCHDOC
size B
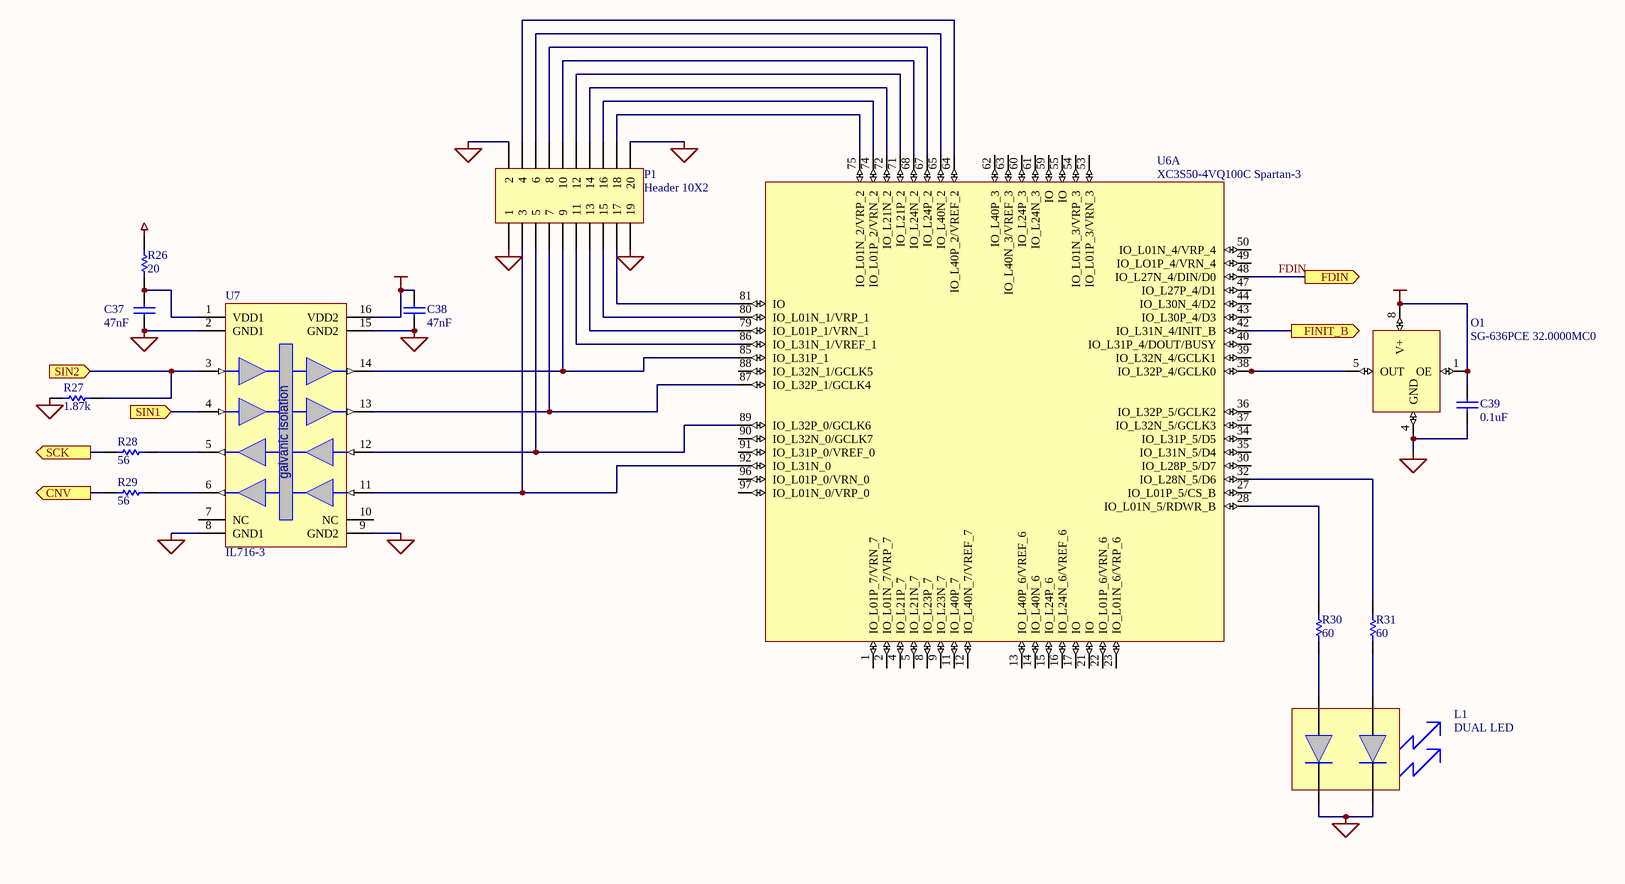
[diagram p9: FPGA.SCHDOC]

### Parts
C37  value 47nF  [CC1608-0603]  (hidden comment: Cap)
C38  value 47nF  [CC1608-0603]  (hidden comment: Cap)
C39  value 0.1uF  [CC1608-0603]  (hidden comment: Cap)
L1  DUAL LED  [LUMEX DUAL RT-ANG LED]
O1  SG-636PCE 32.0000MC0  [SG636PCE]
P1  Header 10X2  [HDR2X10]
R26  value 20  [CC1608-0603]  (hidden comment: Res1)
R27  value 1.87k  [CC1608-0603]  (hidden comment: Res1)
R28  value 56  [CC1608-0603]  (hidden comment: Res1)
R29  value 56  [CC1608-0603]  (hidden comment: Res1)
R30  value 60  [CC1608-0603]  (hidden comment: Res1)
R31  value 60  [CC1608-0603]  (hidden comment: Res1)
U6  XC3S50-4VQ100C Spartan-3  [Xilinx TQ100]  (part A of 2)
U7  IL716-3  [SO-G16/D10]

### Ports
CNV (out), FDIN (out), FINIT_B (out), SCK (out), SIN1 (in), SIN2 (in)

### Nets
AGND: C37.1 R27.1 U7.2(GND1) U7.8(GND1)
AVDD: R26.2
GND: C38.1 C39.2 L1.2 L1.4(C2) O1.4(GND) P1.1 P1.2 P1.19 P1.20 U7.9(GND2) U7.15(GND2)
VCC: C38.2 C39.1 O1.1(OE) O1.8(V+) U7.16(VDD2)
FDIN: U6.48(IO_L27N_4/DIN/D0) ; port FDIN
FINIT_B: U6.42(IO_L31N_4/INIT_B) ; port FINIT_B
NetC37_2: C37.2 R26.1 U7.1(VDD1)
NetL1_1: L1.1(A1) R30.2
NetL1_3: L1.3(A2) R31.2
NetO1_5: O1.5(OUT) U6.38(IO_L32P_4/GCLK0)
NetP1_3: P1.3 U6.92(IO_L31N_0) U7.11(IN4)
NetP1_4: P1.4 U6.64(IO_L40P_2/VREF_2)
NetP1_5: P1.5 U6.89(IO_L32P_0/GCLK6) U7.12(IN3)
NetP1_6: P1.6 U6.65(IO_L40N_2)
NetP1_7: P1.7 U6.87(IO_L32P_1/GCLK4) U7.13(OUT2)
NetP1_8: P1.8 U6.67(IO_L24P_2)
NetP1_9: P1.9 U6.85(IO_L31P_1) U7.14(OUT1)
NetP1_10: P1.10 U6.68(IO_L24N_2)
NetP1_11: P1.11 U6.86(IO_L31N_1/VREF_1)
NetP1_12: P1.12 U6.71(IO_L21P_2)
NetP1_13: P1.13 U6.79(IO_L01P_1/VRN_1)
NetP1_14: P1.14 U6.72(IO_L21N_2)
NetP1_15: P1.15 U6.80(IO_L01N_1/VRP_1)
NetP1_16: P1.16 U6.74(IO_L01P_2/VRN_2)
NetP1_17: P1.17 U6.81(IO)
NetP1_18: P1.18 U6.75(IO_L01N_2/VRP_2)
NetR27_2: R27.2 U7.3(IN1) ; port SIN2
NetR28_1: R28.1 ; port SCK
NetR28_2: R28.2 U7.5(OUT3)
NetR29_1: R29.1 ; port CNV
NetR29_2: R29.2 U7.6(OUT4)
NetR30_1: R30.1 U6.28(IO_L01N_5/RDWR_B)
NetR31_1: R31.1 U6.32(IO_L28N_5/D6)
NetU5:ADC2_7: U7.4(IN2) ; port SIN1

Not connected (* = marked no-connect by the designer): U6 1(IO_L01P_7/VRN_7) 2(IO_L01N_7/VRP_7) 4(IO_L21P_7) 5(IO_L21N_7) 8(IO_L23P_7) 9(IO_L23N_7) 11(IO_L40P_7) 12(IO_L40N_7/VREF_7) 13(IO_L40P_6/VREF_6) 14(IO_L40N_6) 15(IO_L24P_6) 16(IO_L24N_6/VREF_6) 17(IO) 21(IO) 22(IO_L01P_6/VRN_6) 23(IO_L01N_6/VRP_6) 27(IO_L01P_5/CS_B) 30(IO_L28P_5/D7) 34(IO_L31P_5/D5) 35(IO_L31N_5/D4) 36(IO_L32P_5/GCLK2) 37(IO_L32N_5/GCLK3) 39(IO_L32N_4/GCLK1) 40(IO_L31P_4/DOUT/BUSY) 43(IO_L30P_4/D3) 44(IO_L30N_4/D2) 47(IO_L27P_4/D1) 49(IO_LO1P_4/VRN_4) 50(IO_L01N_4/VRP_4) 53(IO_L01P_3/VRN_3) 54(IO_L01N_3/VRP_3) 55(IO) 59(IO) 60(IO_L24P_3) 61(IO_L24N_3) 62(IO_L40P_3) 63(IO_L40N_3/VREF_3) 88(IO_L32N_1/GCLK5) 90(IO_L32N_0/GCLK7) 91(IO_L31P_0/VREF_0) 96(IO_L01P_0/VRN_0) 97(IO_L01N_0/VRP_0); U7 7(NC) 10(NC)

### Notes on the sheet
- (in symbol IL716-3) galvanic isolation

### Library data of the parts
C37-C39 = Cap: as C67 on sheet input; Published: 8-Jun-2000; Revision: July-2002: Re-released for DXP Platform.; Publisher: Altium Limited; Class II: Capacitor
O1 = SG-636PCE: Epson CMOS/TTL Oscillator; Vendor: Epson Electronics America Inc
P1 = Header 10X2: Header, 10-Pin, Dual row; LatestRevisionDate: 17-Jul-2002; LatestRevisionNote: Re-released for DXP Platform.; Publisher: Altium Limited
R26-R31 = Res1: as R13 on sheet AA8513; Published: 8-Jun-2000; Revision: July-2002: Re-released for DXP Platform.; Publisher: Altium Limited; Class II: Resistor
U6 = XC3S50-4VQ100C: Xilinx Spartan-3 VQ100; Vendor: Xilinx
U7 = IL716-3: High speed digital coupler; Vendor: NVE Corp/Isolation Products

## Sheet power.SCHDOC
size A
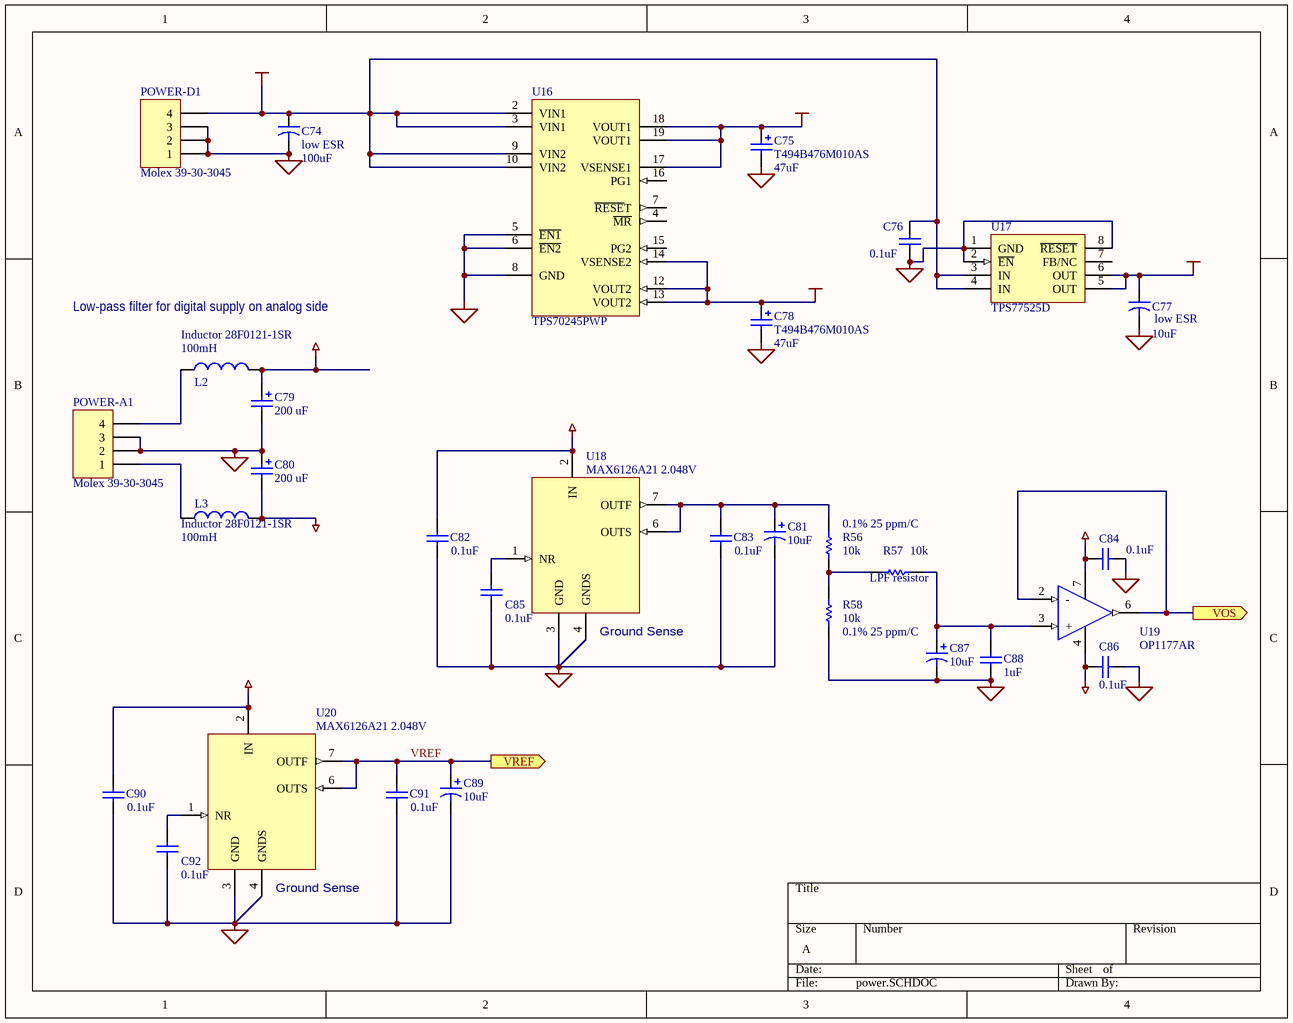
[diagram p10: power.SCHDOC]

### Parts
C74  low ESR  value 100uF  [PanasonicE]
C75  T494B476M010AS  value 47uF  [TC3528-1411]
C76  value 0.1uF  [CC1608-0603]  (hidden comment: Cap)
C77  low ESR  value 10uF  [TC3528-1411]
C78  T494B476M010AS  value 47uF  [TC3528-1411]
C79  value 200 uF  [PanasonicE]
C80  value 200 uF  [PanasonicE]
C81  value 10uF  [TC3528-1411]  (hidden comment: Cap Pol1)
C82  value 0.1uF  [CC1608-0603]  (hidden comment: Cap)
C83  value 0.1uF  [CC1608-0603]  (hidden comment: Cap)
C84  value 0.1uF  [CC1608-0603]  (hidden comment: Cap)
C85  value 0.1uF  [CC1608-0603]  (hidden comment: Cap)
C86  value 0.1uF  [CC1608-0603]  (hidden comment: Cap)
C87  value 10uF  [TC3528-1411]  (hidden comment: Cap Pol1)
C88  value 1uF  [CC1608-0603]  (hidden comment: Cap)
C89  value 10uF  [TC3528-1411]  (hidden comment: Cap Pol1)
C90  value 0.1uF  [CC1608-0603]  (hidden comment: Cap)
C91  value 0.1uF  [CC1608-0603]  (hidden comment: Cap)
C92  value 0.1uF  [CC1608-0603]  (hidden comment: Cap)
L2  Inductor 28F0121-1SR  value 100mH  [STEWARD_1SR]
L3  Inductor 28F0121-1SR  value 100mH  [STEWARD_1SR]
POWER-A1  Molex 39-30-3045  [MJ4RTHR]
POWER-D1  Molex 39-30-3045  [MJ4RTHR]
R56  0.1% 25 ppm/C  value 10k  [CC1608-0603]
R57  LPF resistor  value 10k  [CC1608-0603]
R58  0.1% 25 ppm/C  value 10k  [CC1608-0603]
U16  TPS70245PWP  [PWP PowerPad -20]
U17  TPS77525D  [SO-G8]
U18  MAX6126A21 2.048V  [TSSO3x5-G8/X.35]
U19  OP1177AR  [TSSO3X5-G8/X.4]
U20  MAX6126A21 2.048V  [TSSO3x5-G8/X.35]

### Ports
VOS (out), VREF (out)

### Nets
+1.2VCC: C78.1 U16.12(VOUT2) U16.13(VOUT2) U16.14(VSENSE2)
+2.5VCC: C77.1 U17.5(OUT) U17.6(OUT)
+5VCC: C74.1 C76.1 POWER-D1.4 U16.2(VIN1) U16.3(VIN1) U16.9(VIN2) U16.10(VIN2) U17.3(IN) U17.4(IN)
AGND: C79.2 C80.1 C81.2 C82.2 C83.2 C84.1 C85.2 C86.1 C87.2 C88.2 C89.2 C90.2 C91.2 C92.2 POWER-A1.2 POWER-A1.3 R58.1 U18.3(GND) U18.4(GNDS) U20.3(GND) U20.4(GNDS)
AVDD: C79.1 C82.1 C84.2 C90.1 L2.2 U18.2(IN) U19.7(+Vs) U20.2(IN)
AVSS: C80.2 C86.2 L3.2 U19.4(-Vs)
GND: C74.2 C75.2 C76.2 C77.2 C78.2 POWER-D1.1 POWER-D1.2 POWER-D1.3 U16.5(~{EN1}) U16.6(~{EN2}) U16.8(GND) U16.P1 U16.P2 U16.P3 U16.P4 U16.P5 U16.P6 U16.P7 U16.P8 U16.P9 U16.P10 U16.P11 U16.P12 U16.P13 U16.P14 U16.P15 U16.P16 U16.P17 U17.1(GND) U17.2(~{EN}) U17.8(~{RESET})
VCC: C75.1 U16.17(VSENSE1) U16.18(VOUT1) U16.19(VOUT1)
VOS: U19.2(-) U19.6(Out) ; port VOS
VREF: C89.1 C91.1 U20.6(OUTS) U20.7(OUTF) ; port VREF
NetC81_1: C81.1 C83.1 R56.2 U18.6(OUTS) U18.7(OUTF)
NetC85_1: C85.1 U18.1(NR)
NetC87_1: C87.1 C88.1 R57.1 U19.3(+)
NetC92_1: C92.1 U20.1(NR)
NetL2_1: L2.1 POWER-A1.4
NetL3_1: L3.1 POWER-A1.1
NetR56_1: R56.1 R57.2 R58.2

Not connected (* = marked no-connect by the designer): U16 4(~{MR}) 7(~{RESE}T) 15(PG2) 16(PG1); U17 7(FB/NC)

### Notes on the sheet
- Low-pass filter for digital supply on analog side
- (near U18) Ground Sense
- (near U20) Ground Sense

### Library data of the parts
C74 C77 = Cap2: as C71 on sheet PGA; Published: 23-Sep-2002; Publisher: Altium Limited; Class II: Capacitor
C75 C78 = Cap Pol1: as C25 on sheet AA8513; Published: 8-Jun-2000; Revision: July-2002: Re-released for DXP Platform.; Publisher: Altium Limited; Class II: Capacitor
C76 C82-C86 C88 C90-C92 = Cap: as C67 on sheet input; Published: 8-Jun-2000; Revision: July-2002: Re-released for DXP Platform.; Publisher: Altium Limited; Class II: Capacitor
C79 C80 = Cap Pol3: as C66 on sheet input; Published: 8-Jun-2000; Revision: July-2002: Re-released for DXP Platform.; Publisher: Altium Limited; Class II: Capacitor
C81 C87 C89 = Cap Pol1: Polarized Capacitor (Radial); Published: 8-Jun-2000; LatestRevisionDate: 17-Jul-2002; LatestRevisionNote: Re-released for DXP Platform.; Publisher: Altium Limited
L2 L3 = Inductor: Manufacturer: Generic Components; Class I: Passive; Published: 8-Jun-2000; Revision: July-2002: Re-released for DXP Platform.; Publisher: Altium Limited; Class II: Inductor
POWER-A1 POWER-D1 = Header 4: Header, 4-Pin; Manufacturer: Generic Components; Class I: Connector; Revision: July-2002: Re-released for DXP Platform.; Publisher: Altium Limited
R56-R58 = Res1: as R13 on sheet AA8513; Published: 8-Jun-2000; Revision: July-2002: Re-released for DXP Platform.; Publisher: Altium Limited; Class II: Resistor
U16 = TPS70245PWP: TI dual-output low dropout voltage regulators; Vendor: Texas Instruments
U17 = TPS77525D: Fast-transient-response 500 mA low-dropout voltage regulator; Vendor: Texas Instruments
U18 U20 = MAX6126A21: Ultra-High-Precision, Ultra-Low-Noise, Series Voltage Reference; Vendor: Maxim Integrated Products
U19 = OP1177: Precision Low Noise, Low Input Bias Current Operational Amplifier; Vendor: Analog Devices

## Sheet FPGA Power.SCHDOC
size A
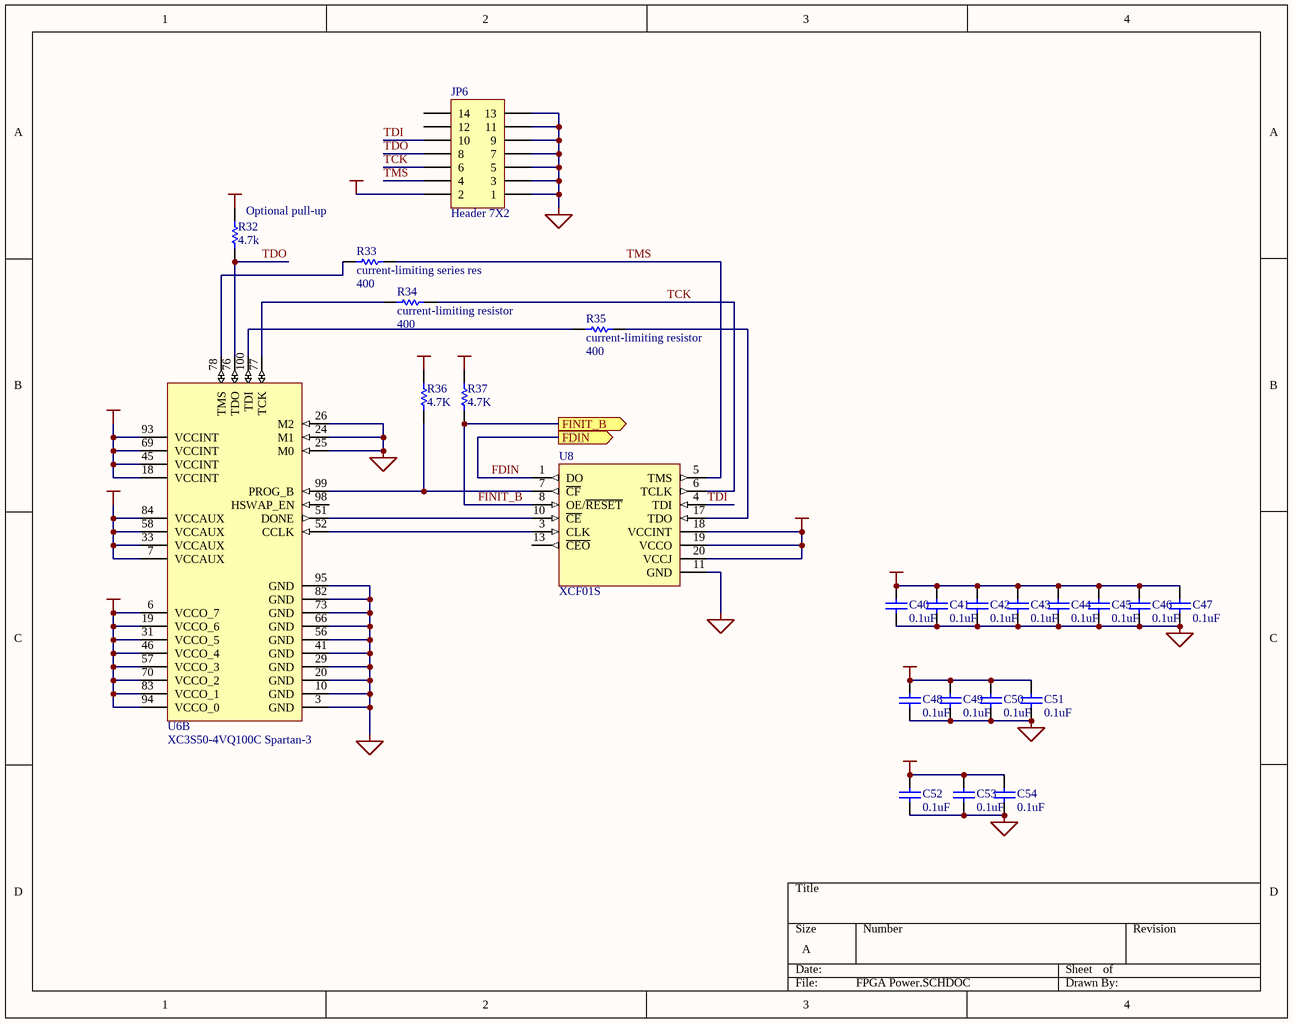
[diagram p11: FPGA Power.SCHDOC]

### Parts
C40  value 0.1uF  [CC1608-0603]  (hidden comment: Cap)
C41  value 0.1uF  [CC1608-0603]  (hidden comment: Cap)
C42  value 0.1uF  [CC1608-0603]  (hidden comment: Cap)
C43  value 0.1uF  [CC1608-0603]  (hidden comment: Cap)
C44  value 0.1uF  [CC1608-0603]  (hidden comment: Cap)
C45  value 0.1uF  [CC1608-0603]  (hidden comment: Cap)
C46  value 0.1uF  [CC1608-0603]  (hidden comment: Cap)
C47  value 0.1uF  [CC1608-0603]  (hidden comment: Cap)
C48  value 0.1uF  [CC1608-0603]  (hidden comment: Cap)
C49  value 0.1uF  [CC1608-0603]  (hidden comment: Cap)
C50  value 0.1uF  [CC1608-0603]  (hidden comment: Cap)
C51  value 0.1uF  [CC1608-0603]  (hidden comment: Cap)
C52  value 0.1uF  [CC1608-0603]  (hidden comment: Cap)
C53  value 0.1uF  [CC1608-0603]  (hidden comment: Cap)
C54  value 0.1uF  [CC1608-0603]  (hidden comment: Cap)
JP6  Header 7X2  [HDR2x7-2mm]
R32  Optional pull-up  value 4.7k  [CC1608-0603]
R33  current-limiting series res  value 400  [CC1608-0603]
R34  current-limiting resistor  value 400  [CC1608-0603]
R35  current-limiting resistor  value 400  [CC1608-0603]
R36  value 4.7K  [CC1608-0603]  (hidden comment: Res1)
R37  value 4.7K  [CC1608-0603]  (hidden comment: Res1)
U6  XC3S50-4VQ100C Spartan-3  [Xilinx TQ100]  (part B of 2)
U8  XCF01S  [TSSO6x6-G20/X.3]

### Ports
FDIN (out), FINIT_B (out)

### Nets
+1.2VCC: C48.1 C49.1 C50.1 C51.1 U6.18(VCCINT) U6.45(VCCINT) U6.69(VCCINT) U6.93(VCCINT)
+2.5VCC: C52.1 C53.1 C54.1 U6.7(VCCAUX) U6.33(VCCAUX) U6.58(VCCAUX) U6.84(VCCAUX)
GND: C40.2 C41.2 C42.2 C43.2 C44.2 C45.2 C46.2 C47.2 C48.2 C49.2 C50.2 C51.2 C52.2 C53.2 C54.2 JP6.1 JP6.3 JP6.5 JP6.7 JP6.9 JP6.11 JP6.13 U6.3(GND) U6.10(GND) U6.20(GND) U6.24(M1) U6.25(M0) U6.26(M2) U6.29(GND) U6.41(GND) U6.56(GND) U6.66(GND) U6.73(GND) U6.82(GND) U6.95(GND) U8.11(GND)
VCC: C40.1 C41.1 C42.1 C43.1 C44.1 C45.1 C46.1 C47.1 JP6.2 R32.2 R36.2 R37.2 U6.6(VCCO_7) U6.19(VCCO_6) U6.31(VCCO_5) U6.46(VCCO_4) U6.57(VCCO_3) U6.70(VCCO_2) U6.83(VCCO_1) U6.94(VCCO_0) U8.18(VCCINT) U8.19(VCCO) U8.20(VCCJ)
FDIN: U8.1(DO) ; port FDIN
FINIT_B: R37.1 U8.8(OE/~{RESET}) ; port FINIT_B
TCK: JP6.6 R34.1 U8.6(TCLK)
TDI: JP6.10 U8.4(TDI)
TDO: JP6.8 R32.1 U6.76(TDO)
TMS: JP6.4 R33.1 U8.5(TMS)
NetR33_2: R33.2 U6.78(TMS)
NetR34_2: R34.2 U6.77(TCK)
NetR35_1: R35.1 U8.17(TDO)
NetR35_2: R35.2 U6.100(TDI)
NetR36_1: R36.1 U6.99(PROG_B) U8.7(~{CF})
NetU6_51: U6.51(DONE) U8.10(~{CE})
NetU6_52: U6.52(CCLK) U8.3(CLK)

Not connected (* = marked no-connect by the designer): JP6 12 14; U6 98(HSWAP_EN); U8 13(~{CEO})

### Library data of the parts
C40-C54 = Cap: as C67 on sheet input; Published: 8-Jun-2000; Revision: July-2002: Re-released for DXP Platform.; Publisher: Altium Limited; Class II: Capacitor
JP6 = Header 7X2: Header, 7-Pin, Dual row; Manufacturer: Generic Components; Class I: Connector; Revision: July-2002: Re-released for DXP Platform.; Publisher: Altium Limited
R32-R37 = Res1: as R13 on sheet AA8513; Published: 8-Jun-2000; Revision: July-2002: Re-released for DXP Platform.; Publisher: Altium Limited; Class II: Resistor
U6 = XC3S50-4VQ100C: Xilinx Spartan-3 VQ100; Vendor: Xilinx
U8 = XCF01S: Xilinx Platform Flash; Vendor: Xilinx

## Nets that join several sheets
+1.2VCC: power (C78.1 U16.12 U16.13 U16.14), FPGA Power (8 pins)
+2.5VCC: power (C77.1 U17.5 U17.6), FPGA Power (7 pins)
AGND: main (102 pins), IN (C66:IN1.2 C67:IN1.2 C68:IN1.1 C69:IN1.2), IN (5 pins), A1 (15 pins), HF (6 pins), PGA (8 pins), H (6 pins), IN (C66:IN3.2 C67:IN3.2 C68:IN3.1 C69:IN3.2), PGA (8 pins), PGA (8 pins), A1 (15 pins), A1 (15 pins), HFS (C64:HFS1.1 C65:HFS1.1 U13:HFS1.3), IN (C66:IN4.2 C67:IN4.2 C68:IN4.1 C69:IN4.2), IN (5 pins), HF (6 pins), PGA (8 pins), H (6 pins), IN (C66:IN6.2 C67:IN6.2 C68:IN6.1 C69:IN6.2), PGA (8 pins), PGA (8 pins), HFS (C64:HFS2.1 C65:HFS2.1 U13:HFS2.3), A2 (16 pins), A2 (16 pins), A2 (16 pins), ADC (7 pins), ADC (7 pins), FPGA (C37.1 R27.1 U7.2 U7.8), power (21 pins)
AVDD: IN (C66:IN1.1 C67:IN1.1 U14:IN1.8), IN (C66:IN2.1 C67:IN2.1 U14:IN2.8), A1 (5 pins), HF (C61:HF1.2 JP8:HF1.2 U11:HF1.4 U12:HF1.7), PGA (6 pins), H (C56:H1.1 JP7:H1.2 U9:H1.7 U10:H1.4), IN (C66:IN3.1 C67:IN3.1 U14:IN3.8), PGA (6 pins), PGA (6 pins), A1 (5 pins), A1 (5 pins), HFS (C64:HFS1.2 U13:HFS1.7), IN (C66:IN4.1 C67:IN4.1 U14:IN4.8), IN (C66:IN5.1 C67:IN5.1 U14:IN5.8), HF (C61:HF2.2 JP8:HF2.2 U11:HF2.4 U12:HF2.7), PGA (6 pins), H (C56:H2.1 JP7:H2.2 U9:H2.7 U10:H2.4), IN (C66:IN6.1 C67:IN6.1 U14:IN6.8), PGA (6 pins), PGA (6 pins), HFS (C64:HFS2.2 U13:HFS2.7), A2 (10 pins), A2 (10 pins), A2 (10 pins), ADC (C34:ADC1.1 C35:ADC1.2 U5:ADC1.2 U5:ADC1.10), ADC (C34:ADC2.1 C35:ADC2.2 U5:ADC2.2 U5:ADC2.10), FPGA (R26.2), power (8 pins)
AVSS: IN (C68:IN1.2 C69:IN1.1 U14:IN1.5), IN (C68:IN2.2 C69:IN2.1 U14:IN2.5), A1 (5 pins), HF (C62:HF1.2 U11:HF1.7 U12:HF1.4), PGA (C72:PGA1.2 C73:PGA1.2 U15:PGA1.4), H (C59:H1.1 U9:H1.4 U10:H1.7), IN (C68:IN3.2 C69:IN3.1 U14:IN3.5), PGA (C72:PGA2.2 C73:PGA2.2 U15:PGA2.4), PGA (C72:PGA3.2 C73:PGA3.2 U15:PGA3.4), A1 (5 pins), A1 (5 pins), HFS (C65:HFS1.2 U13:HFS1.4), IN (C68:IN4.2 C69:IN4.1 U14:IN4.5), IN (C68:IN5.2 C69:IN5.1 U14:IN5.5), HF (C62:HF2.2 U11:HF2.7 U12:HF2.4), PGA (C72:PGA4.2 C73:PGA4.2 U15:PGA4.4), H (C59:H2.1 U9:H2.4 U10:H2.7), IN (C68:IN6.2 C69:IN6.1 U14:IN6.5), PGA (C72:PGA5.2 C73:PGA5.2 U15:PGA5.4), PGA (C72:PGA6.2 C73:PGA6.2 U15:PGA6.4), HFS (C65:HFS2.2 U13:HFS2.4), A2 (6 pins), A2 (6 pins), A2 (6 pins), power (C80.2 C86.2 L3.2 U19.4)
GND: FPGA (11 pins), power (31 pins), FPGA Power (36 pins)
VCC: FPGA (5 pins), power (C75.1 U16.17 U16.18 U16.19), FPGA Power (23 pins)
FDIN: FPGA (U6.48), FPGA Power (U8.1)
FINIT_B: FPGA (U6.42), FPGA Power (R37.1 U8.8)
NetC4:A21_1: main (J17.1 R49.1), A2 (C4:A21.1 R4:A21.1 U2:A21.9)
NetC4:A22_1: main (J22.1 R50.1), A2 (C4:A22.1 R4:A22.1 U2:A22.9)
NetC4:A23_1: main (J27.1 R52.1), A2 (C4:A23.1 R4:A23.1 U2:A23.9)
NetC20:A11_1: main (J7.1 R46.1), A1 (C20:A11.1 R16:A11.1 U3:A11.7)
NetC20:A12_1: main (J12.1 R48.1), A1 (C20:A12.1 R16:A12.1 U3:A12.7)
NetC20:A13_1: main (J2.1 R45.1), A1 (C20:A13.1 R16:A13.1 U3:A13.7)
NetC33:ADC1_2: main (R47.1), ADC (C33:ADC1.2 U5:ADC1.1)
NetC33:ADC2_2: main (R51.1), ADC (C33:ADC2.2 U5:ADC2.1)
NetC57:H1_2: main (J3.1), IN (U14:IN2.7), H (C57:H1.2 U10:H1.8)
NetC57:H2_2: main (J18.1), IN (U14:IN5.7), H (C57:H2.2 U10:H2.8)
NetC63:HFS1_2: IN (U14:IN3.6), HFS (C63:HFS1.2 U13:HFS1.6)
NetC63:HFS2_2: IN (U14:IN6.6), HFS (C63:HFS2.2 U13:HFS2.6)
NetJ1_2: main (J1.2), IN (U14:IN2.1)
NetJ1_3: main (J1.3), IN (U14:IN2.4)
NetJ4_1: main (J4.1), H (U10:H1.1), PGA (U15:PGA3.3)
NetJ5_1: main (J5.1), PGA (U15:PGA3.1), A1 (R17:A13.1)
NetJ6_2: main (J6.2), IN (U14:IN1.1)
NetJ6_3: main (J6.3), IN (U14:IN1.4)
NetJ8_1: main (J8.1 J10.1), IN (U14:IN1.7), HF (R41:HF1.1), PGA (U15:PGA1.3)
NetJ9_1: main (J9.1), A1 (R17:A11.1), PGA (U15:PGA1.1)
NetJ11_2: main (J11.2), IN (U14:IN3.1)
NetJ11_3: main (J11.3), IN (U14:IN3.4)
NetJ13_1: main (J13.1 J15.1), IN (U14:IN3.7), PGA (U15:PGA2.3), HFS (R43:HFS1.1)
NetJ14_1: main (J14.1), PGA (U15:PGA2.1), A1 (R17:A12.1)
NetJ16_2: main (J16.2), IN (U14:IN5.1)
NetJ16_3: main (J16.3), IN (U14:IN5.4)
NetJ19_1: main (J19.1), H (U10:H2.1), PGA (U15:PGA6.3)
NetJ20_1: main (J20.1), PGA (U15:PGA6.1), A2 (R5:A21.1)
NetJ21_2: main (J21.2), IN (U14:IN4.1)
NetJ21_3: main (J21.3), IN (U14:IN4.4)
NetJ23_1: main (J23.1 J25.1), IN (U14:IN4.7), HF (R41:HF2.1), PGA (U15:PGA4.3)
NetJ24_1: main (J24.1), PGA (U15:PGA4.1), A2 (R5:A22.1)
NetJ26_2: main (J26.2), IN (U14:IN6.1)
NetJ26_3: main (J26.3), IN (U14:IN6.4)
NetJ28_1: main (J28.1 J30.1), IN (U14:IN6.7), PGA (U15:PGA5.3), HFS (R43:HFS2.1)
NetJ29_1: main (J29.1), PGA (U15:PGA5.1), A2 (R5:A23.1)
NetR25:ADC1_1: main (R45.2 R46.2 R48.2), ADC (R25:ADC1.1)
NetR25:ADC2_1: main (R49.2 R50.2 R52.2), ADC (R25:ADC2.1)
NetR27_2: ADC (U5:ADC1.7), FPGA (R27.2 U7.3)
NetR28_1: ADC (U5:ADC1.8), ADC (U5:ADC2.8), FPGA (R28.1)
NetR29_1: ADC (U5:ADC1.6), ADC (U5:ADC2.6), FPGA (R29.1)
NetU5:ADC2_7: ADC (U5:ADC2.7), FPGA (U7.4)
NetU11:HF1_1: IN (U14:IN1.6), HF (U11:HF1.1)
NetU11:HF2_1: IN (U14:IN4.6), HF (U11:HF2.1)
VOS: A1 (U3:A11.5), A1 (U3:A12.5), A1 (U3:A13.5), A2 (JP5:A21.1), A2 (JP5:A22.1), A2 (JP5:A23.1), power (U19.2 U19.6)
VREF: main (R47.2 R51.2), power (C89.1 C91.1 U20.6 U20.7)